# Altium schematic sheet rs232_part.SchDoc
size B
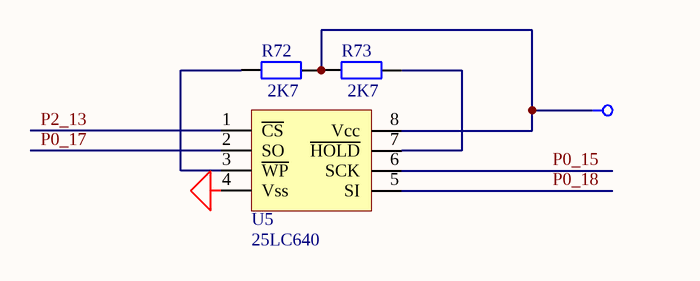
[diagram p0: rs232_part.SchDoc]

## Parts
R72  2K7  [_1206]
R73  2K7  [_1206]
U5  25LC640  [SO-G8/D5]

## Nets
+5v: R72.2 R73.1 U5.8(Vcc)
GND: U5.4(Vss)
P0_15: U5.6(SCK)
P0_17: U5.2(SO)
P0_18: U5.5(SI)
P2_13: U5.1(~{CS})
NetR72_1: R72.1 U5.3(~{WP})
NetR73_2: R73.2 U5.7(~{HOLD})

## Library data of the parts
R72 R73 = Res2: Resistor; Manufacturer: Generic Components; Class I: Passive; Rule: Undefined; Published: 8-Jun-2000; Revision: July-2002: Re-released for DXP Platform.; Publisher: Altium Limited; Class II: Resistor; Value: 2K7